# Altium project Airplane_Navigation_&_Telemetry_Board.PrjPcb
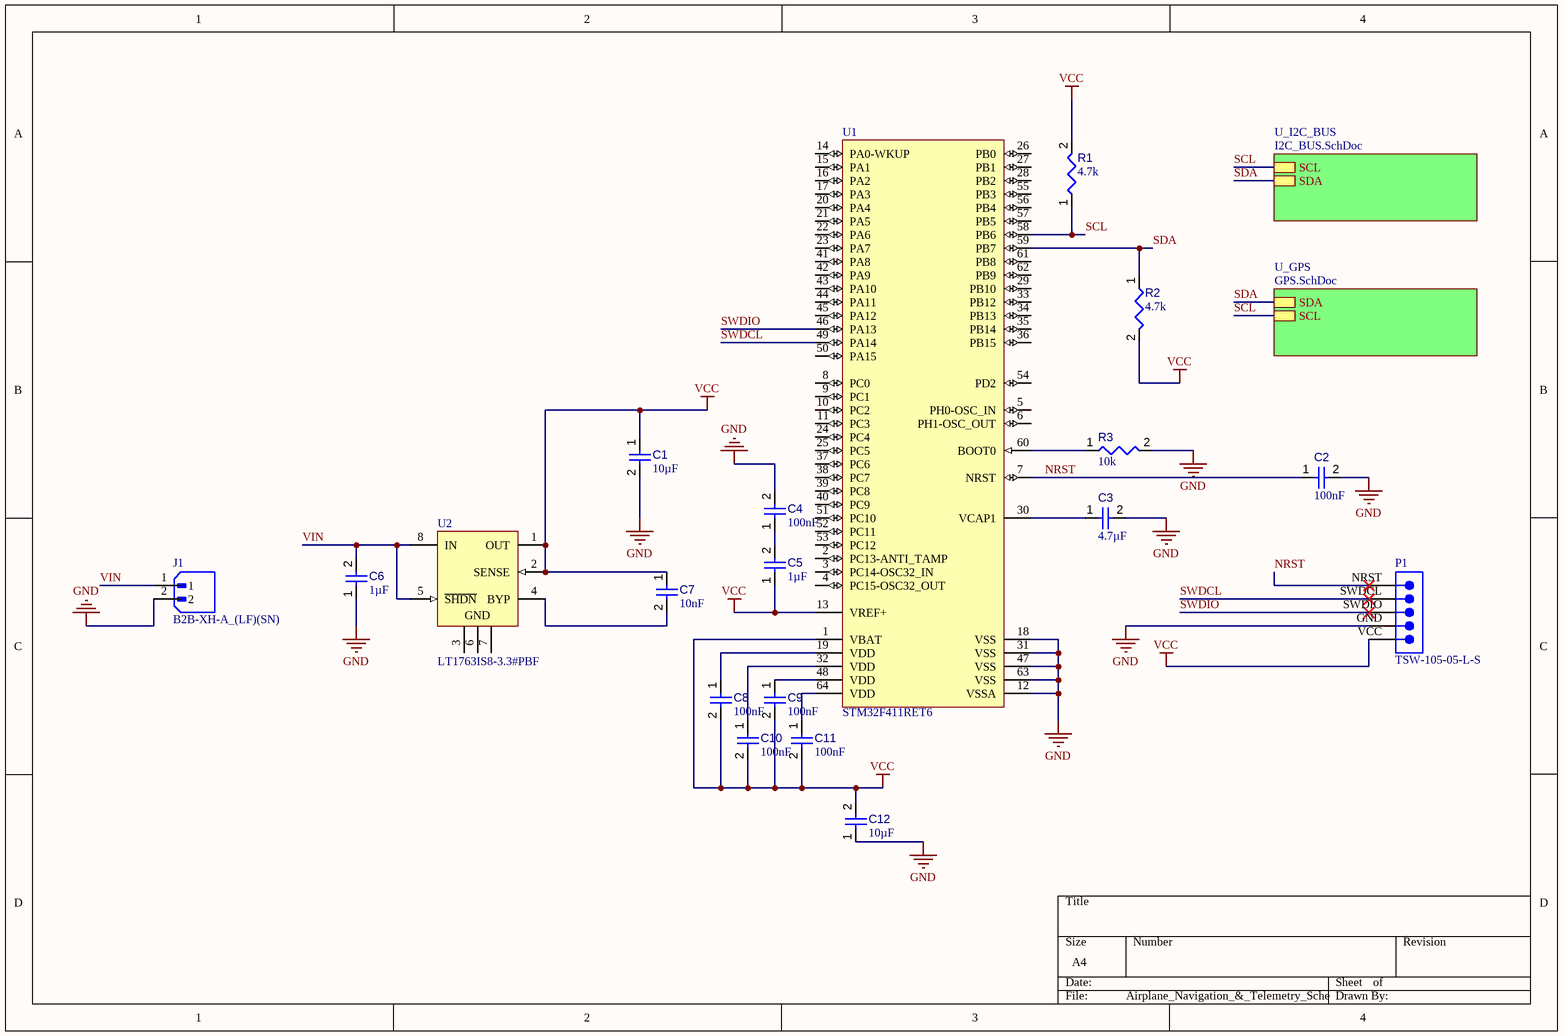
[diagram p0: Airplane_Navigation_&_Telemetry_Schematic.SchDoc]
3 sheets, 34 parts. Net scope: hierarchical (ports join the sheet entries above them; power ports are global).
Board file: Airplane_System_Board.PcbDoc
Sheets:
  Airplane_Navigation_&_Telemetry_Schematic.SchDoc
    U_GPS = GPS.SchDoc
    U_I2C_BUS = I2C_BUS.SchDoc

## Sheet Airplane_Navigation_&_Telemetry_Schematic.SchDoc
size A4; SheetNumber: 1; SheetTotal: 3

### Parts
C1  value 10µF  [CAPC0805(2012)145_L]  (hidden comment: Capacitor 10µF +/-20% 25V 0805)
C2  value 100nF  [CAPC1608X90X40NL10T20]  (hidden comment: Capacitor 100 nF +/-10% 50 V 0603)
C3  value 4.7µF  [CAPC0603(1608)100_L]  (hidden comment: Capacitor 4.7µF +/-20% 10V 0603)
C4  value 100nF  [CAPC1608X90X40NL10T20]  (hidden comment: Capacitor 100 nF +/-10% 50 V 0603)
C5  value 1µF  [CAPC1608X90X35ML15T15]  (hidden comment: Capacitor 1uF +/- 10% 16V 0603)
C6  value 1µF  [CAPC1608X90X35ML15T15]  (hidden comment: Capacitor 1uF +/- 10% 16V 0603)
C7  value 10nF  [CAPC0402(1005)60_L]  (hidden comment: Capacitor 10nF +/-20% 50V 0402)
C8  value 100nF  [CAPC1608X90X40NL10T20]  (hidden comment: Capacitor 100 nF +/-10% 50 V 0603)
C9  value 100nF  [CAPC1608X90X40NL10T20]  (hidden comment: Capacitor 100 nF +/-10% 50 V 0603)
C10  value 100nF  [CAPC1608X90X40NL10T20]  (hidden comment: Capacitor 100 nF +/-10% 50 V 0603)
C11  value 100nF  [CAPC1608X90X40NL10T20]  (hidden comment: Capacitor 100 nF +/-10% 50 V 0603)
C12  value 10µF  [CAPC2013X135X45NL10T25]  (hidden comment: Capacitor 10 uF +/- 10% 16 V 0805)
J1  B2B-XH-A_(LF)(SN)  [JST_B2B-XH-A_(LF)(SN)]
P1  TSW-105-05-L-S  [SMTC-TSW-105-05-X-S]
R1  value 4.7k  [RESC0402(1005)_L]  (hidden comment: Resistor 4K7  +/-1 % 0402 63 mW)
R2  value 4.7k  [RESC0402(1005)_L]  (hidden comment: Resistor 4K7  +/-1 % 0402 63 mW)
R3  value 10k  [RESC1005X40X25ML05T05]  (hidden comment: Resistor 10k +/-1% 0402 100 mW)
U1  STM32F411RET6  [STM-LQFP64_L]
U2  LT1763IS8-3.3#PBF  [LT-S8-8_N]

### Sub-sheets
U_GPS = GPS.SchDoc: SDA, SCL
U_I2C_BUS = I2C_BUS.SchDoc: SCL, SDA

### Nets
GND: C1.2 C2.2 C3.2 C4.2 C6.1 C12.1 J1.2 P1.GND R3.2 U1.12(VSSA) U1.18(VSS) U1.31(VSS) U1.47(VSS) U1.63(VSS)
VCC: C1.1 C5.1 C7.1 C8.2 C9.2 C10.2 C11.2 C12.2 P1.VCC R1.2 R2.2 U1.1(VBAT) U1.13(VREF+) U2.1(OUT) U2.2(SENSE)
NRST: C2.1 P1.NRST U1.7(NRST)
SCL: R1.1 U1.58(PB6) ; sheet U_GPS/SCL, sheet U_I2C_BUS/SCL
SDA: R2.1 U1.59(PB7) ; sheet U_GPS/SDA, sheet U_I2C_BUS/SDA
SWDCL: P1.SWDCL U1.49(PA14)
SWDIO: P1.SWDIO U1.46(PA13)
VIN: C6.2 J1.1 U2.5(~{SHDN}) U2.8(IN)
NetC3_1: C3.1 U1.30(VCAP1)
NetC4_1: C4.1 C5.2
NetC7_2: C7.2 U2.4(BYP)
NetC8_1: C8.1 U1.19(VDD)
NetC9_1: C9.1 U1.48(VDD)
NetC10_1: C10.1 U1.32(VDD)
NetC11_1: C11.1 U1.64(VDD)
NetR3_1: R3.1 U1.60(BOOT0)

Not connected (* = marked no-connect by the designer): U1 2(PC13-ANTI_TAMP) 3(PC14-OSC32_IN) 4(PC15-OSC32_OUT) 5(PH0-OSC_IN) 6(PH1-OSC_OUT) 8(PC0) 9(PC1) 10(PC2) 11(PC3) 14(PA0-WKUP) 15(PA1) 16(PA2) 17(PA3) 20(PA4) 21(PA5) 22(PA6) 23(PA7) 24(PC4) 25(PC5) 26(PB0) 27(PB1) 28(PB2) 29(PB10) 33(PB12) 34(PB13) 35(PB14) 36(PB15) 37(PC6) 38(PC7) 39(PC8) 40(PC9) 41(PA8) 42(PA9) 43(PA10) 44(PA11) 45(PA12) 50(PA15) 51(PC10) 52(PC11) 53(PC12) 54(PD2) 55(PB3) 56(PB4) 57(PB5) 61(PB8) 62(PB9); U2 3(GND) 6(GND) 7(GND)

### Library data of the parts
C1 = CMP-001-00079-4: Chip Capacitor, 10µF +/-20%, 25V, 0805, Thickness 1.45 mm; Tolerance: 10%; Max Operating Temperature: 85°C; Case/Package: 0805; Voltage Rating: 25V; Min Operating Temperature: -55°C; Mounting Technology: SMT; Pins: 2
C2 C4 C8-C11 = CMP-001-00017-6: Chip Capacitor, 100 nF, +/- 10%, 50 V, 0603 (1608 Metric); Voltage Rating: 50V; Capacitor Type: Ceramic; Tolerance: 10%; Mounting Technology: SM; Max Operating Temperature: 125°C; RoHS Compliant: True; Pins: 2; Case/Package: 0603; Min Operating Temperature: -55°C
C3 = CMP-001-00076-4: Chip Capacitor, 4.7µF +/-20%, 10V, 0603, Thickness 1 mm; Tolerance: 10%; Mounting Technology: SMT; Case/Package: 0603; Pins: 2; Min Operating Temperature: -55°C; Max Operating Temperature: 85°C; Voltage Rating: 10V
C5 C6 = CMP-001-00004-6: Chip Capacitor, 1 uF, +/- 10%, 16 V, 0603 (1608 Metric); Capacitor Type: Ceramic; Mounting Technology: SM; RoHS Compliant: True; Min Operating Temperature: -55°C; Case/Package: 0603; Pins: 2; Voltage Rating: 16V; Max Operating Temperature: 125°C; Tolerance: 10%
C7 = CMP-001-00069-3: Chip Capacitor, 10nF +/-20%, 50V, 0402, Thickness 0.6 mm; Tolerance: 5%; Max Operating Temperature: 85°C; Pins: 2; Case/Package: 0402; Voltage Rating: 50V; Min Operating Temperature: -55°C; Mounting Technology: SMT
C12 = CMP-001-00015-6: Chip Capacitor, 10 uF, +/- 10%, 16 V, 0805 (2012 Metric); Voltage Rating: 16V; Capacitor Type: Ceramic; RoHS Compliant: True; Max Operating Temperature: 85°C; Min Operating Temperature: -55°C; Mounting Technology: SM; Tolerance: 10%; Case/Package: 0805; Pins: 2
J1 = CMP-002-00072-1: Connector Header Through Hole 2 position 0.098 (2.50mm); MP: B2B-XH-A (LF)(SN); MF: JST Sales; Pins: 2; Value: *; Check_prices: https://www.snapeda.com/parts/B2B-XH-A%20(LF)(SN)/JST+Sales+America+Inc./view-part/?ref=eda; Case/Package: None; Design Item ID: B2B-XH-A_(LF)(SN); Component Type: Standard; SnapEDA_Link: https://www.snapeda.com/parts/B2B-XH-A%20(LF)(SN)/JST+Sales+America+Inc./view-part/?ref=snap; Source: B2B-XH-A_(LF)(SN).SchLib
P1 = CMP-1024-00366-1: 0.025" SQ Post Header, Through-hole, Vertical, -55 to 125 degC, 2.54 mm Pitch, 5-Pin, Male, RoHS; Manufacturer: Samtec; Pitch: 2.54 mm; PackageVersion: DM, 8/1988; PartNumber: TSW-105-05-L-S; Orientation: Vertical; Temperature Range: -55 to 125 degC; ComponentLink1Description: Manufacturer URL; PackageDescription: .025[0.64] SQ. Post Terminal Strip Assembly; ComponentLink2URL: http://www.samtec.com/documents/webfiles/pdf/TSW_TH.PDF; PackageReference: TSW-105-05-X-S; ComponentLink2Description: Datasheet; Mounting Technology: Through-hole; DatasheetVersion: F-214; ComponentLink1URL: http://www.samtec.com; RoHS: True; ComponentLink3URL: http://www.samtec.com/documents/webfiles/cpdf/TSW-XXX-XX-XXX-X-XX-XXX-MKT.pdf; ComponentLink3Description: Package Specification
R1 R2 = CMP-009-00158-3: Chip Resistor, 4,7 kOhms, +/-1 %, 63 mW, -55 to 155 degC, 0402; Power: 63mW; Tolerance: 1%; Max Operating Temperature: 155°C; Pins: 2; Min Operating Temperature: -55°C; Case/Package: 0402
R3 = CMP-009-00015-5: Chip Resistor, 10 KOhm, +/- 1%, 0.1 W, -55 to 155 degC, 0402 (1005 Metric); Voltage Rating: 50V; Power: 100mW; Case/Package: 0402; RoHS Compliant: True; Min Operating Temperature: -55°C; Mounting Technology: SM; Tolerance: 1%; Max Operating Temperature: 155°C; Pins: 2
U1 = CMP-0243-00169-1: ARM Cortex-M4 32-bit MCU+FPU, 512 KB Flash, 128 KB RAM, 50 I/Os, 64-Pin LQFP, -40 to 85 degC, Tray; Operating Frequency(F) (Processor speed) (MHz): 100; FLASH Size (Prog) (kB): 512; Supply Voltage(Vcc) min (V): 1.7; Internal RAM Size (kB): 128; I/Os (High Current): 50; Packing: Tray; ComponentLink1Description: Manufacturer URL; Package Description: LQFP64; DatasheetVersion: Rev. 6; Mounting Technology: Surface Mount; Package Reference: 64-Pin Low-profile Quad Flat Package, Body 10 x 10 mm, Pitch 0.5 mm; ComponentLink2Description: Datasheet; Core: ARM Cortex-M4; ComponentLink2URL: http://www.st.com/st-web-ui/static/active/en/resource/technical/document/datasheet/DM00115249.pdf; ComponentLink1URL: http://www.st.com/
U2 = CMP-0476-01566-1: 500 mA, Low Noise, LDO Micropower Regulator, 1.8 to 20 V Vin, 3.3 V Vout, 8-pin SOIC (S8-8), -40 to 125 degC, Pb-Free; Manufacturer: Linear Technology; Shutdown Current(uA): 1; Vin Min(V): 1.8; Iout(mA): 500; Noise(uV): 20; Isupply(mA): 0.03; Discrete Pass Element: no; PSRR(dB): 65; Output Voltage: 3.3 V; Dropout Voltage(V): 0.3; ComponentLink3URL: http://cds.linear.com/docs/en/packaging/05081610_G_SO8.pdf; Number of Outputs: 1; ComponentLink2URL: http://cds.linear.com/docs/en/datasheet/1763fg.pdf; ComponentLink1Description: Manufacturer URL; PackageReference: S8-8; DatasheetVersion: Rev. G; ComponentLink3Description: Package Specification; ComponentLink2Description: Datasheet; Mounting Technology: Surface Mount; Vin Max(V): 20; ComponentLink1URL: http://www.linear.com/; PackageDescription: 8-Pin Plastic Small Outline (Narrow .150 Inch), Body 4.9 x 3.9 mm, Pitch 1.27 mm; PartNumber: LT1763IS8-3.3#PBF; RoHS: TRUE; PackageVersion: Rev. G, 03/2012

## Sheet GPS.SchDoc
size A4; SheetNumber: 3; SheetTotal: 3
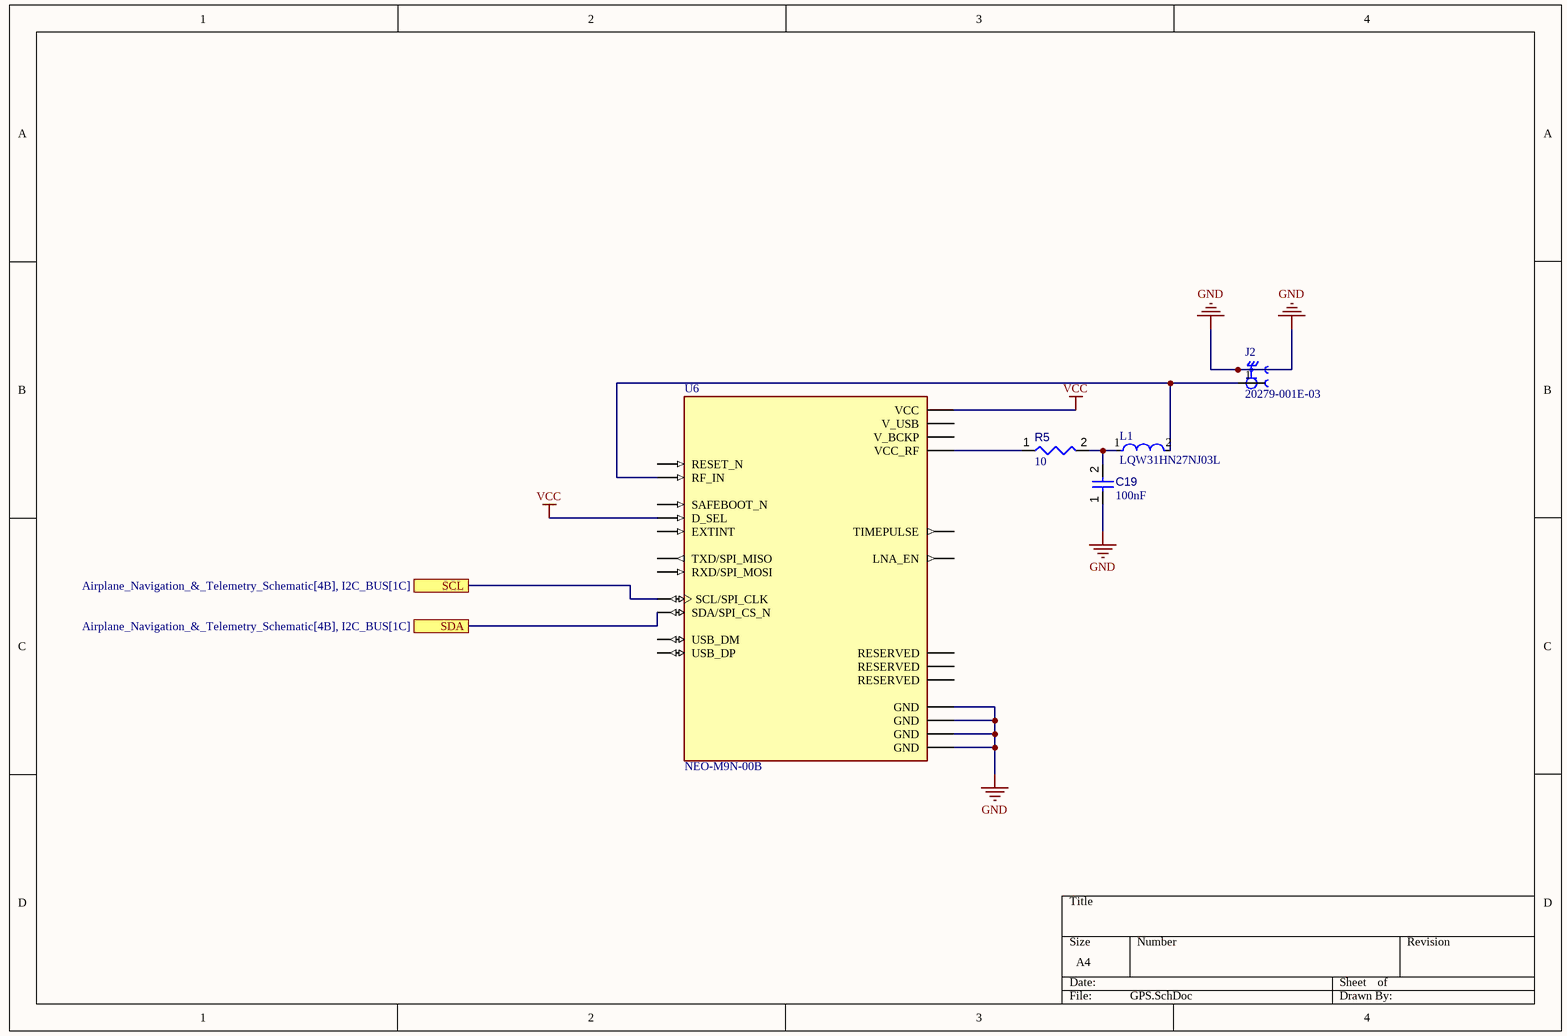
[diagram p1: GPS.SchDoc]

### Parts
C19  value 100nF  [CAPC1608X90X40NL10T20]  (hidden comment: Capacitor 100 nF +/-10% 50 V 0603)
J2  20279-001E-03  [IPEX_20279-001E-03]
L1  LQW31HN27NJ03L  [FP-LQW31HN_03-MFG]
R5  value 10  [RESC0402(1005)_L]  (hidden comment: Resistor 10R  +/-1 % 0402 63 mW)
U6  NEO-M9N-00B  [XCVR_NEO-M9N-00B]

### Ports
SCL (see Airplane_Navigation_&_Telemetry_Schematic[4B], I2C_BUS[1C]), SDA (see Airplane_Navigation_&_Telemetry_Schematic[4B], I2C_BUS[1C])

### Nets
GND: C19.1 J2.2(GROUND) J2.3(GROUND) U6.10(GND) U6.12(GND) U6.13(GND) U6.24(GND)
VCC: U6.2(D_SEL) U6.23(VCC)
SCL: U6.19(SCL/SPI_CLK) ; port SCL
SDA: U6.18(SDA/SPI_CS_N) ; port SDA
NetC19_2: C19.2 L1.1 R5.2
NetJ2_1: J2.1(SIGNAL) L1.2 U6.11(RF_IN)
NetR5_1: R5.1 U6.9(VCC_RF)

Not connected (* = marked no-connect by the designer): U6 1(SAFEBOOT_N) 3(TIMEPULSE) 4(EXTINT) 5(USB_DM) 6(USB_DP) 7(V_USB) 8(RESET_N) 14(LNA_EN) 15(RESERVED) 16(RESERVED) 17(RESERVED) 20(TXD/SPI_MISO) 21(RXD/SPI_MOSI) 22(V_BCKP)

### Library data of the parts
C19 = CMP-001-00017-6: as C2 on sheet Airplane_Navigation_&_Telemetry_Schematic; Tolerance: 10%; Mounting Technology: SM; Max Operating Temperature: 125°C; RoHS Compliant: True; Pins: 2; Case/Package: 0603; Min Operating Temperature: -55°C
J2 = CMP-002-00071-1: 1 POS Vertical SMD Small form factor with big performance through 6 GHz connector,MHF, RF, micro-coaxial MHF I Receptacle; MF: I-PEX; Value: *; Check_prices: https://www.snapeda.com/parts/20279-001E-03/I-PEX/view-part/?ref=eda; Component Type: Standard; Case/Package: None; MP: 20279-001E-03; Source: 20279-001E-03.SchLib; SnapEDA_Link: https://www.snapeda.com/parts/20279-001E-03/I-PEX/view-part/?ref=snap; Pins: 3; Design Item ID: 20279-001E-03
L1 = CMP-06042-006372-1: Wire Wound RF Inductor 27nH ±5% 0.0714Ω 560mA 1206; Self Resonant Frequency: 1GHz; Shielding: Unshielded; Core Material: Ferrite; Test Frequency: 100MHz; Q Factor: 60; DC Resistance (DCR): 51mR; Mount: Surface Mount; Inductance: 27nH; Max DC Current: 560mA; Military Standard: Not; Height: 1.8mm; Width: 0.063inch; Case Code (Metric): 3216; Height - Seated (Max): 0.079inch; Min Operating Temperature: -40°C; Weight: 0.000705oz; Package Quantity: 2000; Max Operating Temperature: 85°C; Current Rating: 560mA; Case Code (Imperial): 1206; Packaging: Tape and Reel; DC Current: 560mA; Termination: SMD/SMT; Depth: 1.8mm; Resistor Type: Wirewound; Radiation Hardening: No; Case/Package: 1206; Length: 3.2mm; Tolerance: 5%
R5 = CMP-009-00152-3: Chip Resistor, 10 Ohms, +/-1 %, 63 mW, -55 to 155 degC, 0402; Tolerance: 1%; Power: 63mW; Pins: 2; Max Operating Temperature: 155°C; Min Operating Temperature: -55°C; Case/Package: 0402
U6 = CMP-015-000000-1: series RF Receiver BeiDou, Galileo, GLONASS, GNSS, GPS - -167dBm - - Module; MF: u-blox; SnapEDA_Link: https://www.snapeda.com/parts/NEO-M9N-00B/u-blox/view-part/?ref=snap; MP: NEO-M9N-00B; Source: NEO-M9N-00B.SchLib; Check_prices: https://www.snapeda.com/parts/NEO-M9N-00B/u-blox/view-part/?ref=eda; Value: *; Package: SMD-24 u-blox; Design Item ID: NEO-M9N-00B; Pin Count: 24; Component Type: Standard

## Sheet I2C_BUS.SchDoc
size A4; SheetNumber: 2; SheetTotal: 3
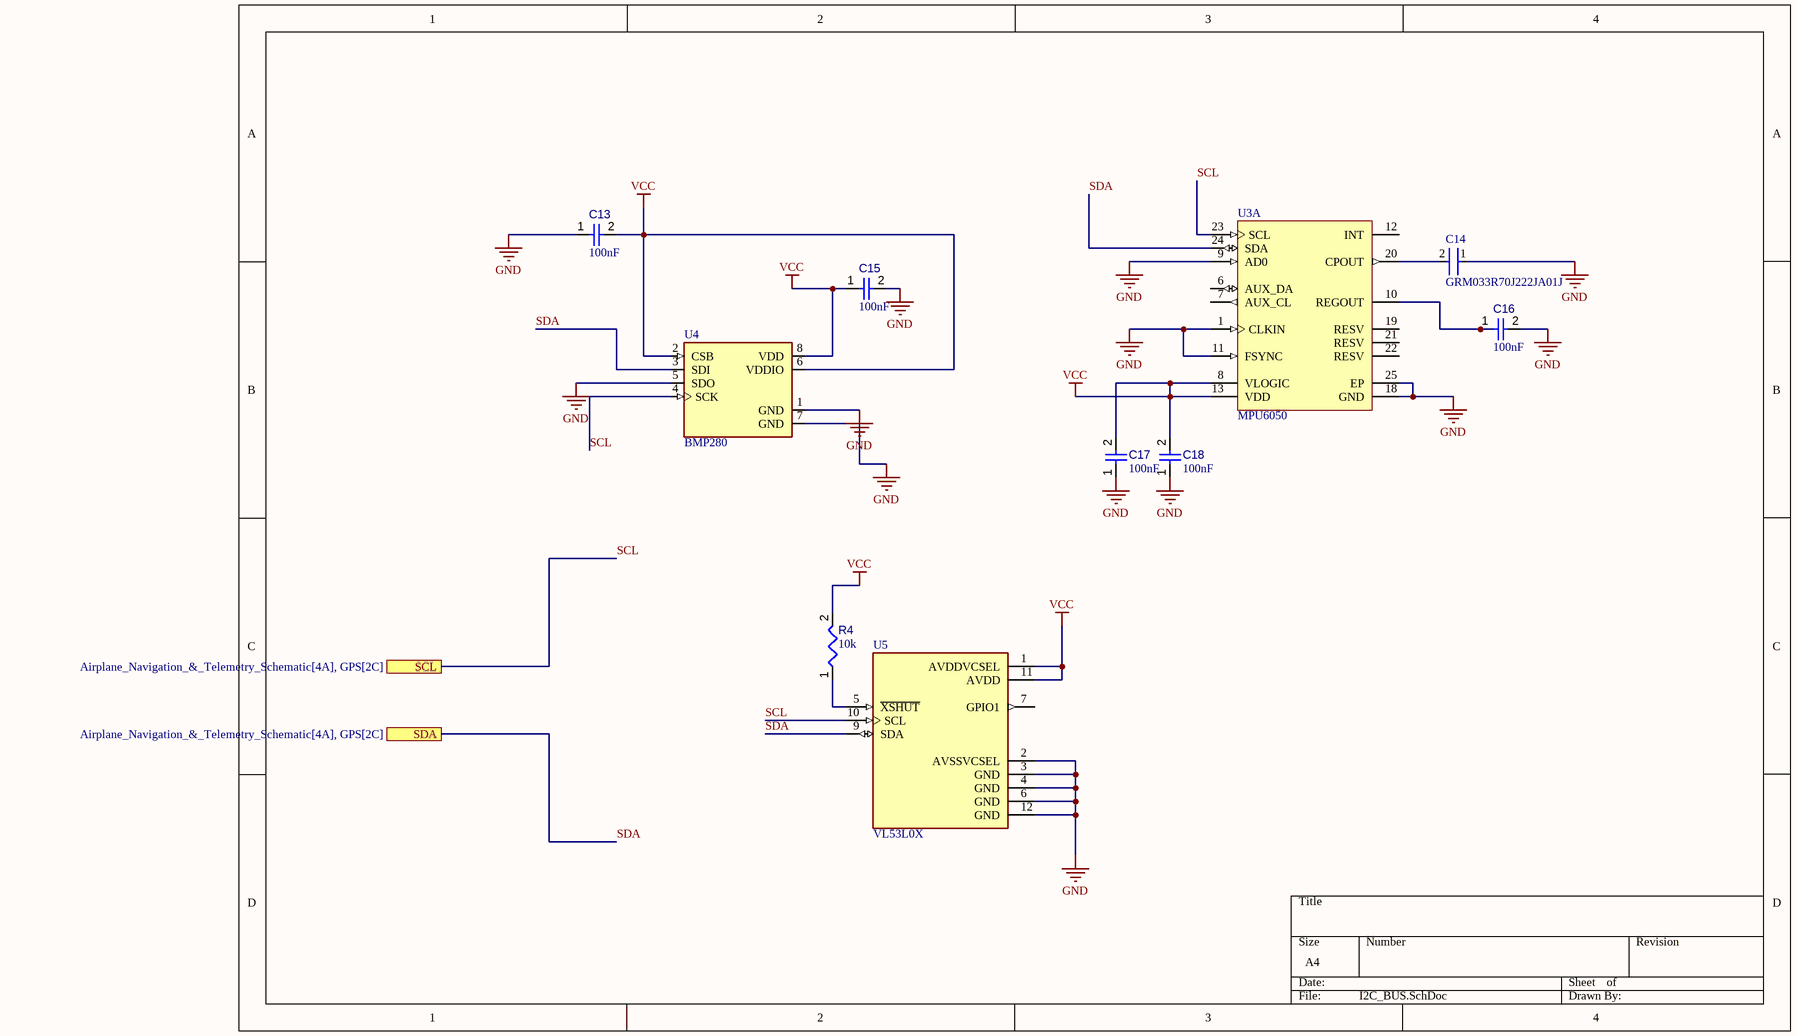
[diagram p2: I2C_BUS.SchDoc]

### Parts
C13  value 100nF  [CAPC0402(1005)60_L]  (hidden comment: Capacitor 100nF +/-20% 10V 0402)
C14  GRM033R70J222JA01J  [FP-GRM033-0_03-IPC_B]
C15  value 100nF  [CAPC0402(1005)60_L]  (hidden comment: Capacitor 100nF +/-20% 10V 0402)
C16  value 100nF  [CAPC1005X56X25LL10T15]  (hidden comment: Capacitor 0.1 uF +/- 5% 16 V 0402)
C17  value 100nF  [CAPC0402(1005)60_L]  (hidden comment: Capacitor 100nF +/-20% 10V 0402)
C18  value 100nF  [CAPC0402(1005)60_L]  (hidden comment: Capacitor 100nF +/-20% 10V 0402)
R4  value 10k  [RESC1005X40X25ML05T05]  (hidden comment: Resistor 10k +/-1% 0402 100 mW)
U3  MPU6050  [INSE-QFN-24_V]  (part A of 2)
U4  BMP280  [XDCR_BMP280]
U5  VL53L0X  [SENSOR_VL53L0X]

### Ports
SCL (see Airplane_Navigation_&_Telemetry_Schematic[4A], GPS[2C]), SDA (see Airplane_Navigation_&_Telemetry_Schematic[4A], GPS[2C])

### Nets
GND: C13.1 C14.1 C15.2 C16.2 C17.1 C18.1 U3.1(CLKIN) U3.9(AD0) U3.11(FSYNC) U3.18(GND) U3.25(EP) U4.1(GND) U4.5(SDO) U4.7(GND) U5.2(AVSSVCSEL) U5.3(GND) U5.4(GND) U5.6(GND) U5.12(GND)
VCC: C13.2 C15.1 C17.2 C18.2 R4.2 U3.8(VLOGIC) U3.13(VDD) U4.2(CSB) U4.6(VDDIO) U4.8(VDD) U5.1(AVDDVCSEL) U5.11(AVDD)
SCL: U3.23(SCL) U4.4(SCK) U5.10(SCL) ; port SCL
SDA: U3.24(SDA) U4.3(SDI) U5.9(SDA) ; port SDA
NetC14_2: C14.2 U3.20(CPOUT)
NetC16_1: C16.1 U3.10(REGOUT)
NetR4_1: R4.1 U5.5(~{XSHUT})

Not connected (* = marked no-connect by the designer): U3 6(AUX_DA) 7(AUX_CL) 12(INT) 19(RESV) 21(RESV) 22(RESV); U5 7(GPIO1)

### Library data of the parts
C13 C15 C17 C18 = CMP-001-00061-3: Chip Capacitor, 100nF +/-20%, 10V, 0402, Thickness 0.6 mm; Tolerance: 20%; Mounting Technology: SMT; Voltage Rating: 10V; Max Operating Temperature: 85°C; Pins: 2; Case/Package: 0402; Min Operating Temperature: -55°C
C14 = CMP-06035-025705-1: Chip Multilayer Ceramic Capacitors for General Purpose, 0201, 2200pF, X7R, 15%, 5%, 6.3V; Capacitance: 2.2nF; Voltage Rating (DC): 6.3V; Dielectric: X7R; Tolerance: 5%; Width: 300um; Thickness: 300um; Length: 600um
C16 = CMP-001-00001-6: Chip Capacitor, 0.1 uF, +/- 5%, 16 V, 0402 (1005 Metric); Capacitor Type: Ceramic; Voltage Rating: 16V; Max Operating Temperature: 125°C; Min Operating Temperature: -55°C; Case/Package: 0402; Mounting Technology: SM; Pins: 2; Tolerance: 5%; RoHS Compliant: True
R4 = CMP-009-00015-5: as R3 on sheet Airplane_Navigation_&_Telemetry_Schematic; Case/Package: 0402; RoHS Compliant: True; Min Operating Temperature: -55°C; Mounting Technology: SM; Tolerance: 1%; Max Operating Temperature: 155°C; Pins: 2
U3 = CMP-010-00014-3: 3-Axis Gyroscope, 3-Axis Accelerometer, 2.375 to 3.46 V, -40 to 105 degC, 24-Pin QFN, RoHS, Tape and Reel; Manufacturer: InvenSense; Max Supply Voltage: 3.6V; Min Supply Voltage: 2.5V; Sensor Type: Motion; Interface: I2C; Min Operating Temperature: -40°C; Case/Package: QFN; Package Quantity: 5000; Pins: 24; RoHS Compliant: True; Packaging: CutTape; Datasheet URL: https://datasheet.ciiva.com/1513/1788002-1513632.pdf; Package Reference: QFN-24; Datasheet Version: Rev. 3.4, 08/2013; Package Description: 24-Pin Quad Flat No-lead Package, Body 4 x 4 mm, Pitch 0.5 mm; Max Operating Temperature: 85°C; Mounting Technology: SM
U4 = CMP-00029-00001-1: BMP280 Absolute Barometric Pressure Sensor for Battery Powered Devices 2 x 2.5mm; Value: *; Source: BMP280.SchLib; Price: None; Component Type: Standard; Availability: Unavailable; Case/Package: None; Pins: 8; MP: BMP280; Design Item ID: BMP280
U5 = CMP-013-000000-1: VL53L0X - Light, 3D Time-of-Flight _ToF_ Sensor Evaluation Board; MF: STMicroelectronics; Value: *; Pin Count: 11; MP: VL53L0X; Price: None; Availability: Unavailable; Source: SnapEDAsch.SchLib; Design Item ID: VL53L0X; SnapEDA_Link: https://www.snapeda.com/parts/VL53L0X/STMicroelectronics/view-part/473967/?ref=snap; Component Type: Standard; Package: None

## Nets that join several sheets
GND: Airplane_Navigation_&_Telemetry_Schematic (14 pins), GPS (7 pins), I2C_BUS (19 pins)
VCC: Airplane_Navigation_&_Telemetry_Schematic (15 pins), GPS (U6.2 U6.23), I2C_BUS (12 pins)
SCL: Airplane_Navigation_&_Telemetry_Schematic (R1.1 U1.58), GPS (U6.19), I2C_BUS (U3.23 U4.4 U5.10)
SDA: Airplane_Navigation_&_Telemetry_Schematic (R2.1 U1.59), GPS (U6.18), I2C_BUS (U3.24 U4.3 U5.9)